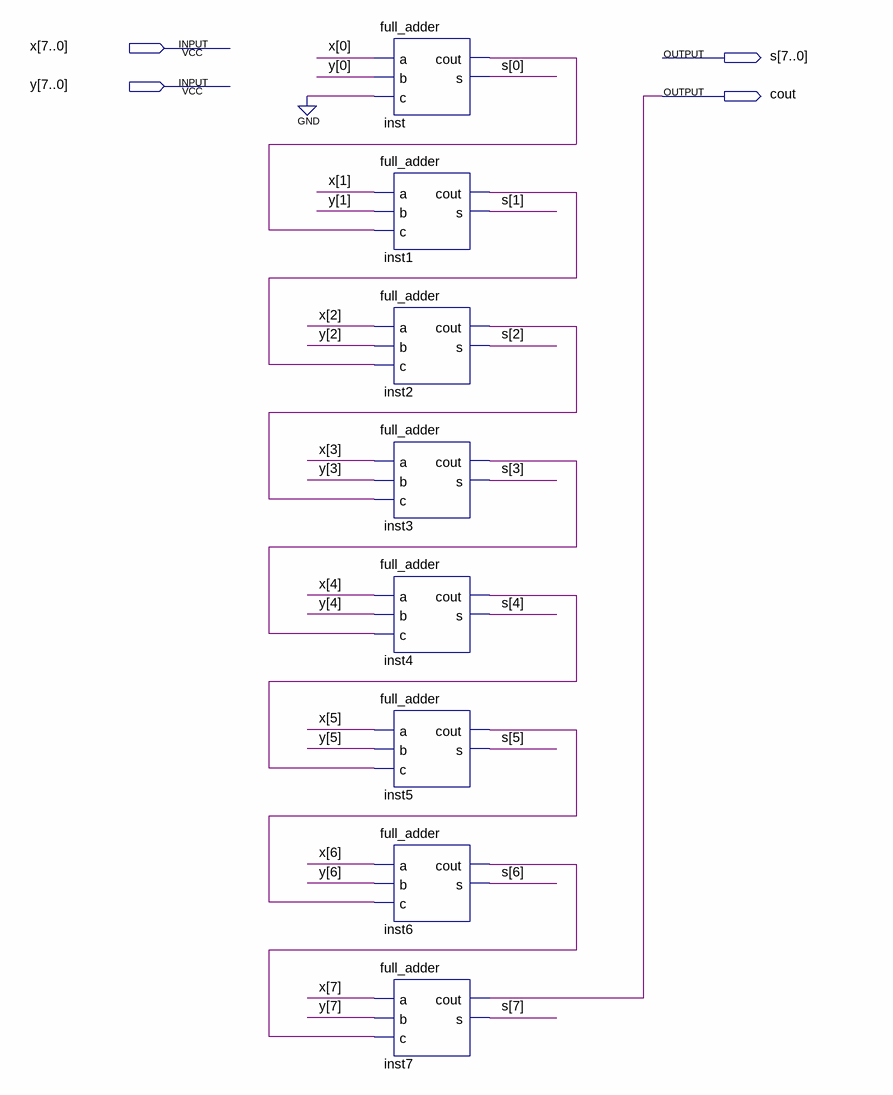
[diagram p0: schematic sheet]
// Quartus schematic rca.bdf as structural Verilog: 8 symbols, 4 pins
module rca (
  input  [7:0] x,
  input  [7:0] y,
  output [7:0] s,
  output cout
);

  wire inst1_cout, inst2_cout, inst3_cout, inst4_cout, inst5_cout, inst6_cout, inst_cout;

  full_adder inst (.a(x[0]), .b(y[0]), .c(1'b0), .cout(inst_cout), .s(s[0]));
  full_adder inst1 (.a(x[1]), .b(y[1]), .c(inst_cout), .cout(inst1_cout), .s(s[1]));
  full_adder inst2 (.a(x[2]), .b(y[2]), .c(inst1_cout), .cout(inst2_cout), .s(s[2]));
  full_adder inst3 (.a(x[3]), .b(y[3]), .c(inst2_cout), .cout(inst3_cout), .s(s[3]));
  full_adder inst4 (.a(x[4]), .b(y[4]), .c(inst3_cout), .cout(inst4_cout), .s(s[4]));
  full_adder inst5 (.a(x[5]), .b(y[5]), .c(inst4_cout), .cout(inst5_cout), .s(s[5]));
  full_adder inst6 (.a(x[6]), .b(y[6]), .c(inst5_cout), .cout(inst6_cout), .s(s[6]));
  full_adder inst7 (.a(x[7]), .b(y[7]), .c(inst6_cout), .cout(cout), .s(s[7]));
endmodule
